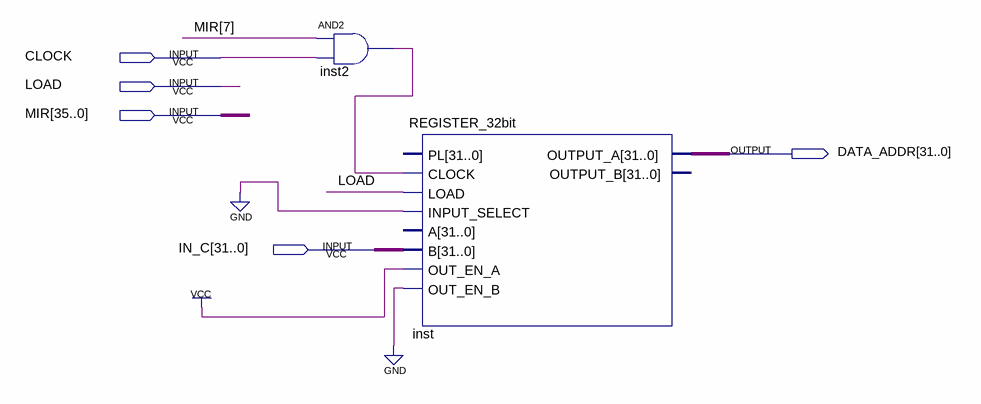
[diagram p0: schematic sheet]
// Quartus schematic MAR.bdf as structural Verilog: 2 symbols, 5 pins
module MAR (
  input  CLOCK,
  input  LOAD,
  input  [35:0] MIR,
  input  [31:0] IN_C,
  output [31:0] DATA_ADDR
);

  wire inst2_out;

  and inst2 (inst2_out, MIR[7], CLOCK);
  REGISTER_32bit inst (
    .CLOCK(inst2_out), .LOAD(LOAD), .INPUT_SELECT(1'b0), .B(IN_C), .OUT_EN_A(1'b1), .OUT_EN_B(1'b0),
    .OUTPUT_A(DATA_ADDR));  // open: PL, A, OUTPUT_B
endmodule
